# EasyEDA Pro project USB2SPI.eprj

# Schematic USB2SPI
Create Date: 2022-11-13; Page Name: Core; Project Name: USB2SPI; Schematic Name: USB2SPI; Update Date: 2023-05-25; Company: 嘉立创EDA; Page Size: A4; Version: V1.0
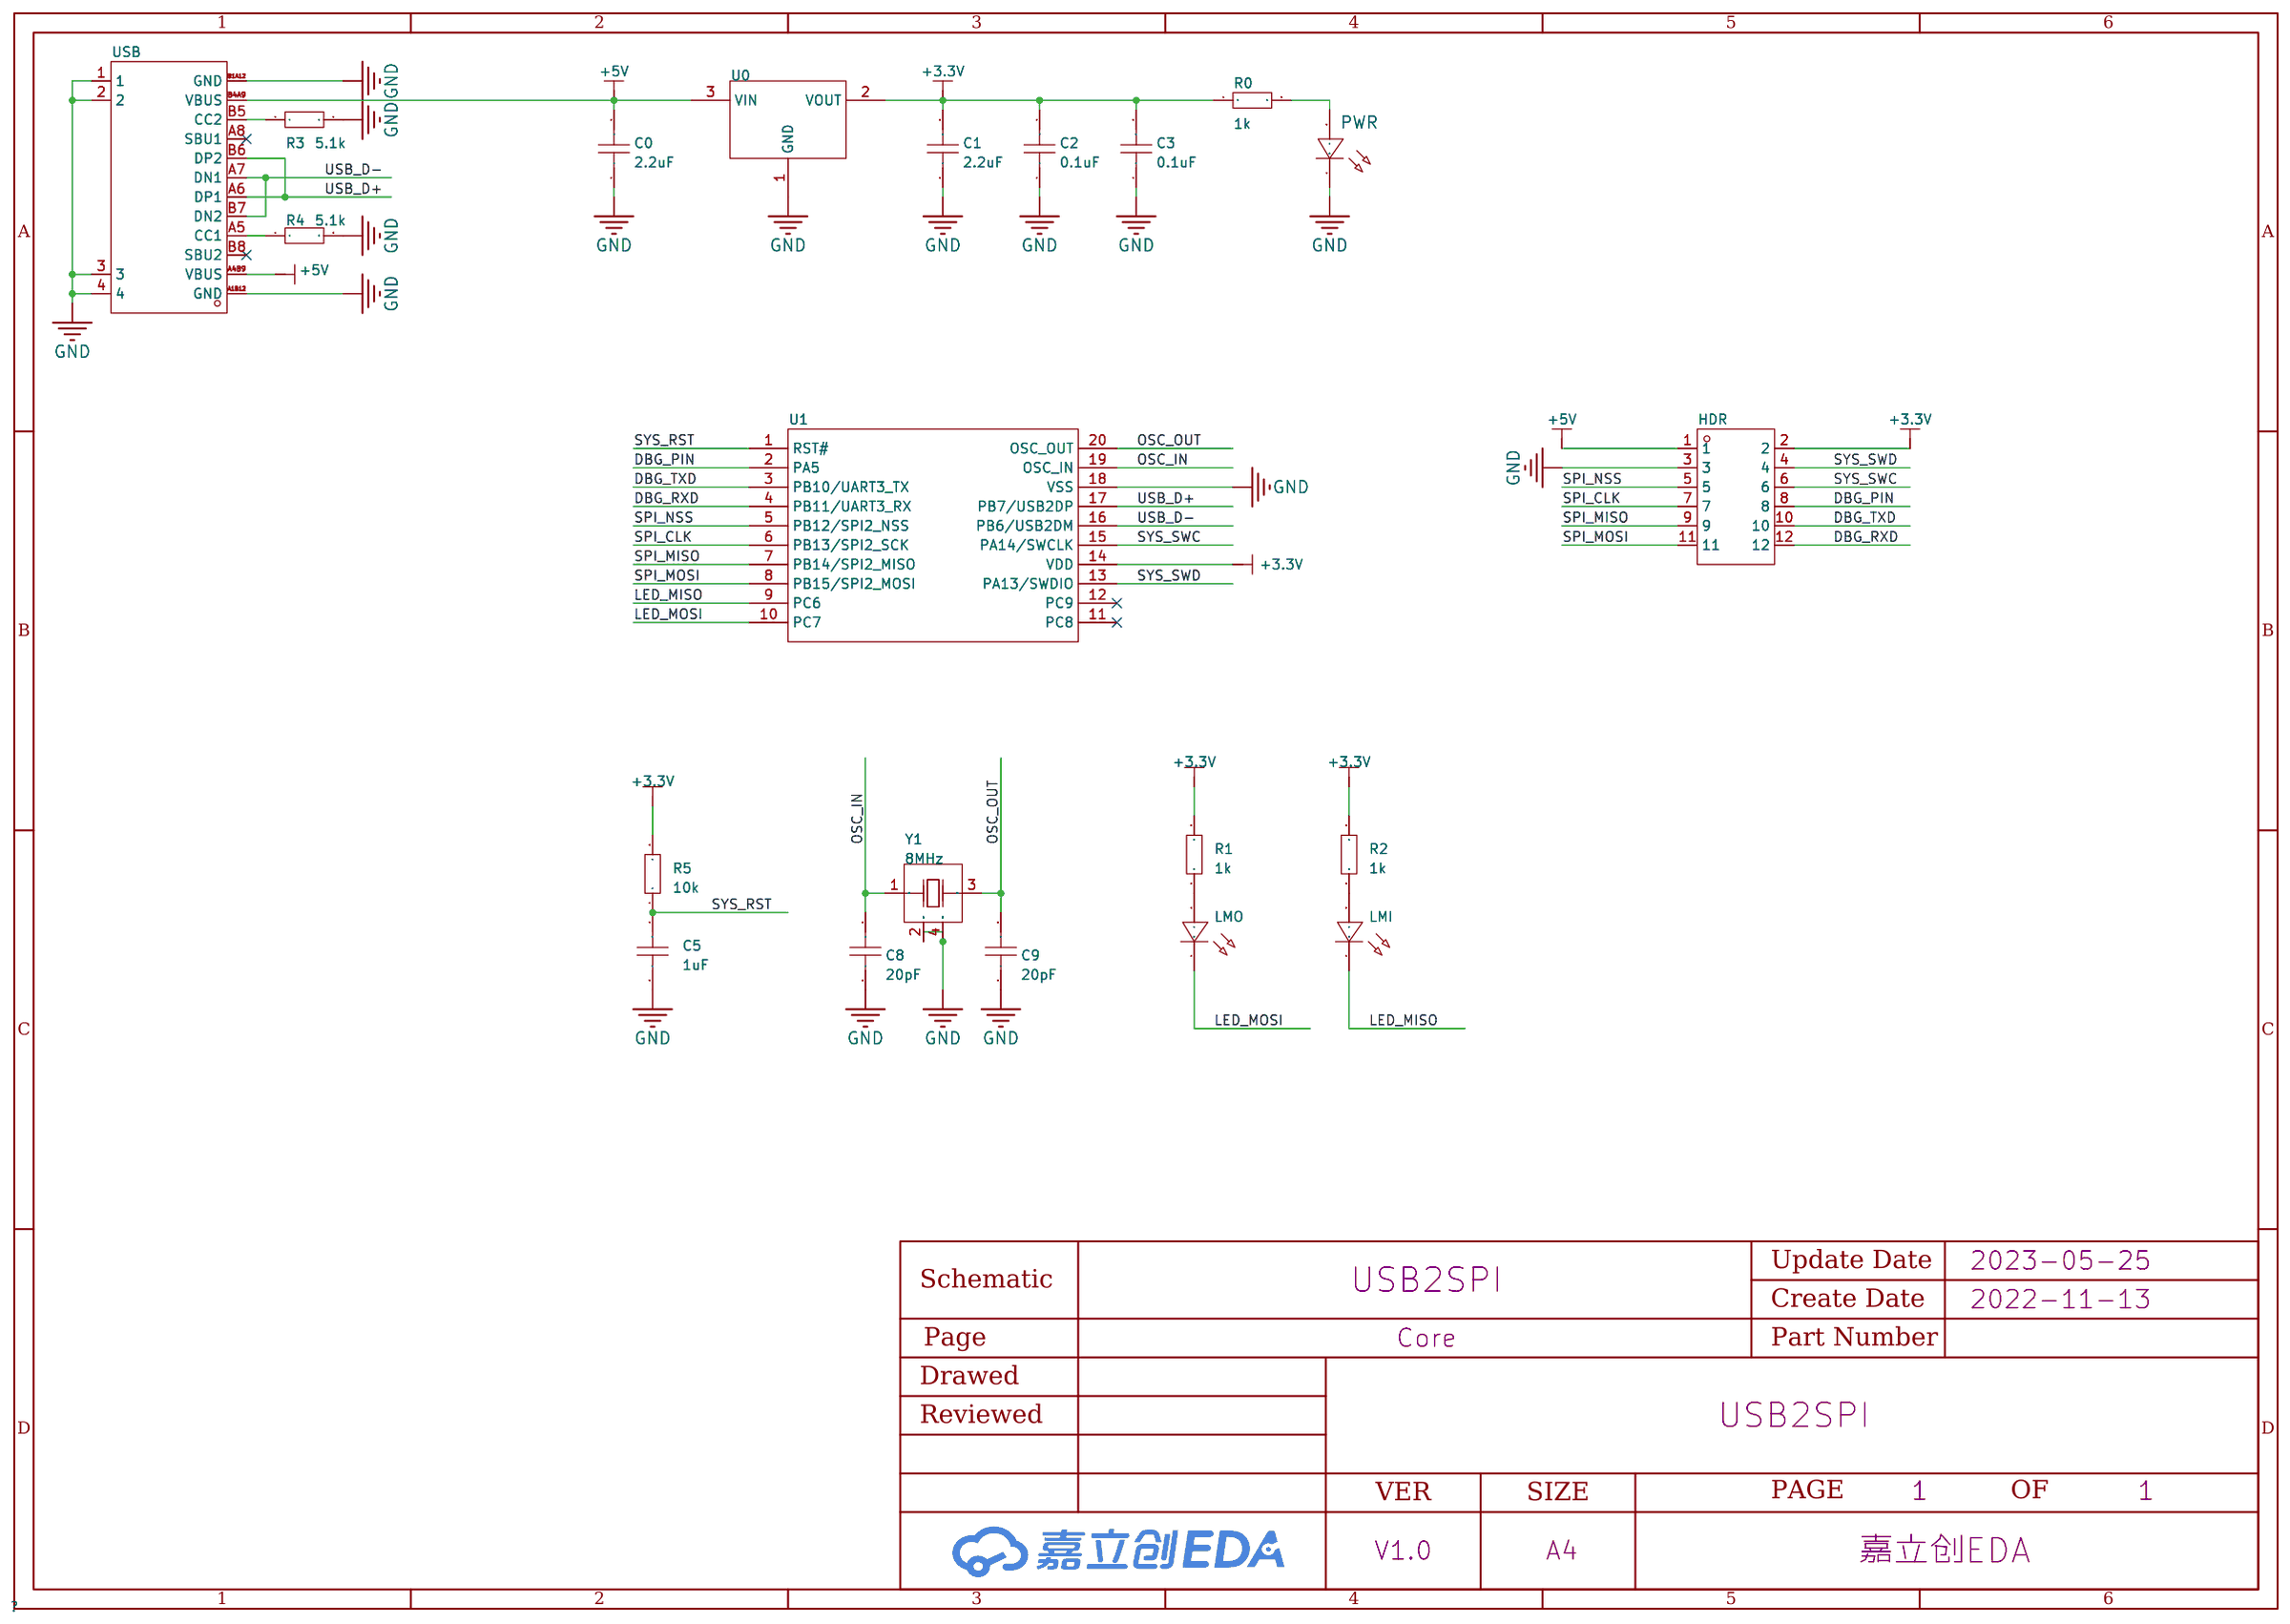
[diagram p0: schematic sheet]

## Parts
C0  2.2uF  [C0603]
C1  2.2uF  [C0603]
C2  0.1uF  [C0603]
C3  0.1uF  [C0603]
C5  1uF  [C0603]
C8  20pF  [C0603]
C9  20pF  [C0603]
HDR  -  [HDR-SMD_2X6P-P2.54]
LMI  -  [LED0603-RD]
LMO  -  [LED0603-RD]
PWR  -  [LED0603-RD_BLUE]
R0  1k  [R0603]
R1  1k  [R0603]
R2  1k  [R0603]
R3  5.1k  [R0603]
R4  5.1k  [R0603]
R5  10k  [R0603]
U0  HT7233  [SOT-23-3_L2.9-W1.6-P1.90-LS2.8-BR]
U1  -  [TSSOP-20_L6.5-W4.4-P0.65-LS6.4-BL]
USB  USB-TYPE-C-017  [USB-TYPE-C-SMD_C9900008089]
Y1  8MHz  [OSC-SMD_4P-L3.2-W2.5-BL]

## Library data of the parts
C0-C3 C5 C8 C9 = CAP_0603: 容值:100nF;精度:±10%;额定电压:50V;温度系数:X7R;; Supplier Footprint: 0603
HDR = HDR-M_2.54_2x6: Supplier Part: C30734; Supplier Footprint: 插件,P=2.54mm
LMI LMO = LED_0603-G: 照明颜色:翠绿;色温 - CCT（K）:-;主波长/色坐标:520~535nm;; Supplier Footprint: 0603; Supplier Part: C72043
PWR = LED_0603-R: 发光颜色:红灯;二极管配置:-;透镜颜色:无色透明;主波长:617.5nm;峰值波长:632nm;色温:-;光通量(25时):-;测试电流:5mA;正向电压(VF):2.2V;发光强度:28.5mcd;功率:60mW;发光角度:120°;安装方式:-;工作温度:-40~+85;; Supplier Footprint: 0603; Supplier Part: C72044
R0-R5 = Res_0603: Supplier Footprint: 0603
U0 = HT7233: 输出类型:固定;输出极性:正;输出通道数:1;最大输入电压:8V;输出电压:3.3V;压差:300mV@(300mA);静态电流(地电流):-;输出电流:300mA;电源纹波抑制比(PRSS):-;; LCSC Part Name: Vin=8V Vout=3.3V 300mA; Supplier Part: C47970; Manufacturer: HOLTEK(台湾合泰/盛群); Supplier Footprint: SOT-23(SOT-23-3); JLCPCB Part Class: 扩展库; Datasheet: https://atta.szlcsc.com/upload/public/pdf/source/20150618/1457707321217.pdf; Supplier: LCSC; Output Type: 固定; Output Polarity: 正; Number of Outputs: 1; Maximum Input Voltage: 8V; Output Voltage: 3.3V; Dropout Voltage: 300mV@(300mA); Output Current: 300mA
U1 = CH32V305FBP6
USB = USB-TYPE-C-017: 连接器类型:Type-C;标准:-;公母:母座;触点数量:16;端口数量:1;安装方式:卧贴;额定电流 - 电源:3A;工作温度范围:-25~+85;; Supplier Part: C2927037; Manufacturer: DEALON(德艺隆); Supplier Footprint: SMD; JLCPCB Part Class: 扩展库; Datasheet: https://atta.szlcsc.com/upload/public/pdf/source/20211217/653222EE5174722C9DFE2966329956D8.pdf; Supplier: LCSC; Connector Type: Type-C; Gender: 母座; Number of Contacts: 16; Number of Ports: 1; Mounting Style: 卧贴; Current Rating - Power (Max): 3A; Operating Temperature Range: -25~+85
Y1 = X322512MSB4SI: 晶振类型:贴片无源晶振;频率:12MHz;频率公差:±10ppm;频率稳定度:±30ppm;负载电容:20pF;工作温度:-40~+85;; LCSC Part Name: 12MHz ±10ppm 20pF; Supplier Part: C9002; Manufacturer: YXC(扬兴晶振); Supplier Footprint: SMD3225-4P; JLCPCB Part Class: 基础库; Datasheet: https://atta.szlcsc.com/upload/public/pdf/source/20210329/C112971_1F611BDC486E193C1706F6D8EB5AA189.pdf; Supplier: LCSC; Crystal Type: 贴片无源晶振; Frequency Tolerance: ±10ppm; Frequency Stability: ±30ppm; Load Capacitance: 20pF; Operating Temperature: -40~+85

## Nets
+3.3V: C1.2 C2.2 C3.2 HDR.2 R0.1 R1.2 R2.2 R5.2 U0.2(VOUT) U1.14(VDD)
+5V: C0.2 HDR.1 U0.3(VIN) USB.A4B9(VBUS) USB.B4A9(VBUS)
GND: C0.1 C1.1 C2.1 C3.1 C5.2 C8.2 C9.1 HDR.3 PWR.1(C) R3.2 R4.2 U0.1(GND) U1.18(VSS) USB.1 USB.2 USB.3 USB.4 USB.A1B12(GND) USB.B1A12(GND) Y1.2(GND) Y1.4(GND)
DBG_PIN: HDR.8 U1.2(PA5)
DBG_RXD: HDR.12 U1.4(PB11/UART3_RX)
DBG_TXD: HDR.10 U1.3(PB10/UART3_TX)
LED_MISO: LMI.1(C) U1.9(PC6)
LED_MOSI: LMO.1(C) U1.10(PC7)
OSC_IN: C8.1 U1.19(OSC_IN) Y1.1(OSC1)
OSC_OUT: C9.2 U1.20(OSC_OUT) Y1.3(OSC2)
SPI_CLK: HDR.7 U1.6(PB13/SPI2_SCK)
SPI_MISO: HDR.9 U1.7(PB14/SPI2_MISO)
SPI_MOSI: HDR.11 U1.8(PB15/SPI2_MOSI)
SPI_NSS: HDR.5 U1.5(PB12/SPI2_NSS)
SYS_RST: C5.1 R5.1 U1.1(RST#)
SYS_SWC: HDR.6 U1.15(PA14/SWCLK)
SYS_SWD: HDR.4 U1.13(PA13/SWDIO)
USB_D+: U1.17(PB7/USB2DP) USB.A6(DP1) USB.B6(DP2)
USB_D-: U1.16(PB6/USB2DM) USB.A7(DN1) USB.B7(DN2)
$1N2511: R4.1 USB.A5(CC1)
$1N2512: R3.1 USB.B5(CC2)
$1N2528: PWR.2(A) R0.2
$1N5878: LMO.2(A) R1.1
$1N5967: LMI.2(A) R2.1

Not connected (* = marked no-connect by the designer): U1 11(PC8)* 12(PC9)*; USB A8(SBU1)* B8(SBU2)*

# Board USB2SPI
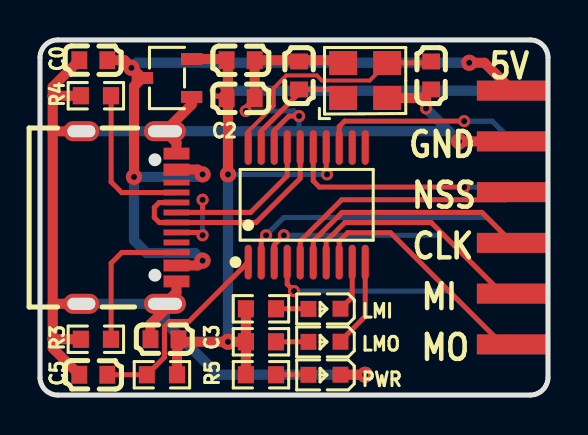
[diagram p1: board, top side]
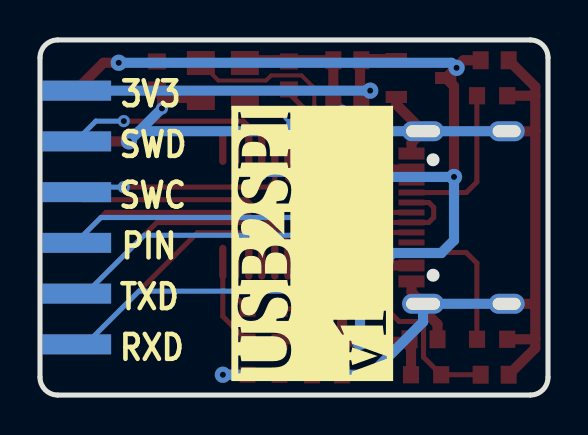
[diagram p2: board, bottom side, seen from below]

Outline 25.4 x 17.78 mm; copper layers: Top Layer, Bottom Layer. Coordinates in mm from the lower left corner of the outline.
Outline path: 0,16.89 0,0.89 arc(0.26,0.26) 0.89,0 24.51,0 arc(25.14,0.26) 25.4,0.89 25.4,16.89 arc(25.14,17.52) 24.51,17.78 0.89,17.78 arc(0.26,17.52) 0,16.89
Stack: Top Layer 0.035mm / Dielectric1 1.51mm FR4 er 4.5 / Bottom Layer 0.035mm

## Design rules (mm)
net USB_D+: DP1
net USB_D-: DP1
spacing safeClearance (default): track to track 0.152, other pairs 0.152 to 0.3
track width trackWidth (default): min 0.127, default 0.254, max 2.54
differential pair differentialPair (default): width min 0.127, default 0.254, max 2.54; gap min 0.152, default 0.152
via viaSize (default): diameter min 0.5, default 0.61, max 10; hole min 0.3, default 0.305, max 6

## Placement (name value [footprint] x y rotation side)
C0  2.2uF  [C0603]  2.67 16.76 0 top
C1  2.2uF  [C0603]  10.03 16.76 180 top
C2  0.1uF  [C0603]  10.03 14.86 180 top
C3  0.1uF  [C0603]  6.22 2.79 0 top
C5  1uF  [C0603]  2.67 1.02 180 top
C8  20pF  [C0603]  12.95 16 90 top
C9  20pF  [C0603]  19.56 16 90 top
HDR  -  [HDR-SMD_2X6P-P2.54]  23.62 15.24 0 top
LMI  -  [LED0603-RD]  14.22 4.32 180 top
LMO  -  [LED0603-RD]  14.22 2.67 180 top
PWR  -  [LED0603-RD_BLUE]  14.22 1.02 180 top
R0  1k  [R0603]  11.05 1.02 0 top
R1  1k  [R0603]  11.05 2.67 180 top
R2  1k  [R0603]  11.05 4.32 180 top
R3  5.1k  [R0603]  2.79 2.79 180 top
R4  5.1k  [R0603]  2.79 14.99 180 top
R5  10k  [R0603]  6.1 1.02 0 top
U0  HT7233  [SOT-23-3_L2.9-W1.6-P1.90-LS2.8-BR]  6.35 15.88 0 top
U1  -  [TSSOP-20_L6.5-W4.4-P0.65-LS6.4-BL]  13.34 9.53 0 top
USB  USB-TYPE-C-017  [USB-TYPE-C-SMD_C9900008089]  4.44 8.89 270 top
Y1  8MHz  [OSC-SMD_4P-L3.2-W2.5-BL]  16.26 15.75 0 top

## Footprints (pads in the part's own frame, mm; a bottom-side part is the same pattern mirrored in y, then rotated)
C0603
  rect 0.8x0.9 smd: 1(-0.7,0) 2(0.7,0)
HDR-SMD_2X6P-P2.54
  rect 3.556x1 smd: 1(0,0) 3(0,-2.54) 5(0,-5.08) 7(0,-7.62) 9(0,-10.16) 11(0,-12.7)
  rect 3.556x1 smd far side: 2(0,0) 4(0,-2.54) 6(0,-5.08) 8(0,-7.62) 10(0,-10.16) 12(0,-12.7)
LED0603-RD
  rect 0.8x0.8 smd: 1(-0.799,-0.004) 2(0.799,0.004)
LED0603-RD_BLUE
  rect 0.8x0.8 smd: 1(-0.8,-0.003) 2(0.8,0.003)
OSC-SMD_4P-L3.2-W2.5-BL
  rect 1.4x1.2 smd: 1(-1.1,-0.875) 2(1.1,-0.875) 3(1.1,0.875) 4(-1.1,0.875)
R0603
  rect 0.806x0.864 smd: 1(-0.753,0) 2(0.753,0)
SOT-23-3_L2.9-W1.6-P1.90-LS2.8-BR
  rect 1.07x0.6 smd: 1(1.235,-0.95) 2(1.235,0.95) 3(-1.235,0)
TSSOP-20_L6.5-W4.4-P0.65-LS6.4-BL
  oval 0.364x1.742 smd: 1(-2.925,-2.871) 2(-2.275,-2.871) 3(-1.625,-2.871) 4(-0.975,-2.871) 5(-0.325,-2.871) 6(0.325,-2.871) 7(0.975,-2.871) 8(1.625,-2.871) 9(2.275,-2.871) 10(2.925,-2.871) 11(2.925,2.871) 12(2.275,2.871) 13(1.625,2.871) 14(0.975,2.871) 15(0.325,2.871) 16(-0.325,2.871) 17(-0.975,2.871) 18(-1.625,2.871) 19(-2.275,2.871) 20(-2.925,2.871)
USB-TYPE-C-SMD_C9900008089
  oval 1x2.1 hole 0.6x1.7: 1(-4.32,1.801) 2(4.32,1.801)
  oval 1x1.8 hole 0.6x1.4: 3(-4.32,-2.379) 4(4.32,-2.379)
  rect 0.6x1.3 smd: A1B12(-3.2,2.379) A4B9(-2.4,2.379) B1A12(3.2,2.379) B4A9(2.4,2.379)
  rect 0.3x1.3 smd: A5(-1.25,2.379) A6(-0.25,2.379) A7(0.25,2.379) A8(1.25,2.379) B5(1.75,2.379) B6(0.75,2.379) B7(-0.75,2.379) B8(-1.75,2.379)

## Nets
As in the schematic.

Pads without a net: U1 11 12; USB A8 B8

## Via types
v1: diameter 0.61, hole 0.305, Top Layer to Bottom Layer, 11 vias
v2: diameter 0.813, hole 0.305, Top Layer to Bottom Layer, 10 vias

## Routing (per net, layer and track width the routed paths; a pad name or vN(x,y) marks a point on that pad's centre or on a via; arc(x,y) is an arc through that point)
+3.3V: length 45.6
  Top Layer w0.254: v1(14.35,11.05) 14.31,11.09 U1.14
  Top Layer w0.508: R1.2 R0.1 ; R1.2 v2(9.4,2.67) 7.16,2.67 6.85,2.36 ; R1.2 R2.2 ; v2(9.4,11.05) 9.4,16.7 C1.2 9.27,16.83 U0.2 ; 6.85,2.36 R5.2 ; 6.85,2.36 6.85,2.72 C3.2
  Bottom Layer w0.254: v1(14.35,11.05) v2(9.4,11.05)
  Bottom Layer w0.508: v2(9.4,11.05) v2(9.4,2.67) ; HDR.2 v2(8.89,15.24)
+5V: length 40.3
  Top Layer w0.508: USB.B4A9 7.89,6.49 v2(8.13,6.73) ; v2(8.13,11.05) 7.89,11.29 USB.A4B9 ; v2(21.46,16.64) 22.22,16.64 HDR.1 ; v2(4.57,16.38) 4.59,16.37 4.62,16.37 ; 4.62,16.37 4.23,16.76 C0.2 ; 4.62,16.37 5.12,15.88 4.7,15.46 v2(4.7,10.92)
  Bottom Layer w0.508: v2(21.46,16.64) 4.83,16.64 v2(4.57,16.38) ; v2(8.13,11.05) 8,10.92 v2(4.7,10.92) 4.7,7.75 5.33,7.11 7.75,7.11 v2(8.13,6.73)
GND: length 86.6
  Top Layer w0.254: v1(10.29,14.22) 10.29,14.41 C2.1 ; U1.18 11.71,13.23 12.45,13.97 v1(12.95,13.97)
  Top Layer w0.508: C5.2 0.63,2.35 0.63,2.81 ; USB.3 2.06,13.2 0.63,13.2 ; R4.2 0.64,14.99 0.63,14.98 ; 19.3,15.05 C9.1 ; 19.3,15.05 19.13,14.87 Y1.2 ; 19.3,15.05 v1(19.3,14.35) ; 0.63,2.81 0.65,2.79 R3.2 ; 0.63,2.81 0.63,13.2 ; C2.1 C1.1 15.01,16.76 Y1.4 ; 0.63,13.2 0.63,14.98 ; v2(16.26,1.02) 16.25,1.02 PWR.1 ; 0.63,14.98 0.63,15.43 C0.1 ; U0.1 7.59,14.55 USB.1 6.82,12.63 USB.A1B12 ; USB.4 0.64,4.57 ; USB.B1A12 6.82,5.15 USB.2 6.25,4.27 5.52,3.55 C3.1 ; v2(20.96,12.7) HDR.3
  Bottom Layer w0.254: 12.96,13.21 12.95,13.21 v1(12.95,13.97) 12.7,14.22 v1(10.29,14.22)
  Bottom Layer w0.508: 20.44,13.21 USB.1 USB.3 ; 20.44,13.21 v2(20.96,12.7) ; 20.44,13.21 v1(19.3,14.35) ; USB.4 USB.2 6.25,3.66 8.89,1.02 v2(16.26,1.02)
DBG_PIN: length 14.7
  Top Layer w0.254: U1.2 11.06,7.76 v1(11.3,8)
  Bottom Layer w0.254: HDR.8 22.35,8.89 12.19,8.89 v1(11.3,8)
DBG_RXD: length 13.6
  Top Layer w0.254: U1.4 12.36,5.55 v1(12.7,5.21)
  Bottom Layer w0.254: HDR.12 23.11,2.54 20.45,5.21 v1(12.7,5.21)
DBG_TXD: length 14.2
  Top Layer w0.254: U1.3 11.71,7.52 v1(12.19,8)
  Bottom Layer w0.254: v1(12.19,8) 20.19,8 23.11,5.08 HDR.10
LED_MISO: length 2.6
  Top Layer w0.254: U1.9 15.61,4.91 LMI.1
LED_MOSI: length 4.5
  Top Layer w0.254: U1.10 16.26,3.94 15.02,2.7 LMO.1
OSC_IN: length 6.1
  Top Layer w0.254: Y1.1 14.73,15.3 C8.1 12.95,15.11 11.06,13.22 U1.19
OSC_OUT: length 12.1
  Top Layer w0.203: U1.20 10.41,13.2 11.68,14.48 11.68,15.37 12.32,16 13.84,16 14.1,15.75 16.48,15.75 Y1.3
  Top Layer w0.254: Y1.3 19.48,16.62 C9.2
SPI_CLK: length 12.2
  Top Layer w0.254: U1.6 13.66,7.7 15.1,9.14 22.1,9.14 HDR.7
SPI_MISO: length 12.2
  Top Layer w0.254: U1.7 14.31,7.71 15.24,8.64 19.56,8.64 23.11,5.08 HDR.9
SPI_MOSI: length 12.2
  Top Layer w0.254: U1.8 14.96,7.7 15.38,8.13 17.53,8.13 23.11,2.54 HDR.11
SPI_NSS: length 12.7
  Top Layer w0.254: U1.5 13.01,7.7 15.09,9.78 23.24,9.78 HDR.5
SYS_RST: length 10.3
  Top Layer w0.254: C5.1 R5.1 6.22,1.9 6.22,3.43 6.48,3.68 7.44,3.68 U1.1
SYS_SWC: length 11.9
  Top Layer w0.254: v1(21.21,10.41) 13.97,10.41 13.66,10.72 U1.15
  Bottom Layer w0.254: v1(21.21,10.41) 23.37,10.41 HDR.6
SYS_SWD: length 10.2
  Top Layer w0.254: U1.13 14.96,13.44 15.23,13.72 v1(21.21,13.72)
  Bottom Layer w0.254: v1(21.21,13.72) 22.61,13.72 HDR.4
USB_D+: length 11.5
  Top Layer w0.254: USB.A6 6.83,9.14 8.11,9.14 ; v1(8.13,8) 7.99,8.14 USB.B6 ; 8.11,9.14 8.13,9.16 v1(8.13,9.78) ; 8.11,9.14 10.53,9.14 12.36,10.98 U1.17
  Bottom Layer w0.254: v1(8.13,9.78) v1(8.13,8)
USB_D-: length 11.6
  Top Layer w0.254: USB.B7 5.96,9.64 5.72,9.4 5.72,8.89 5.97,8.64 USB.A7 10.8,8.64 13.01,10.85 U1.16
$1N2511: length 7.8
  Top Layer w0.254: R4.1 3.56,14.98 3.56,10.67 4.08,10.14 USB.A5
$1N2512: length 7.3
  Top Layer w0.254: USB.B5 4.09,7.14 3.56,6.6 3.56,2.8 R3.1
$1N2528: length 1.6
  Top Layer w0.254: PWR.2 13.42,1.02 R0.2
$1N5878: length 1.6
  Top Layer w0.254: LMO.2 13.42,2.67 R1.1
$1N5967: length 1.6
  Top Layer w0.254: R2.1 13.42,4.32 LMI.2

## Text on the board
Bottom Silkscreen Layer: PIN | 3V3 | TXD | RXD | SWD | SWC | USB2SPI / v1
Top Silkscreen Layer: GND | NSS | CLK | MO | MI | 5V
